# EAGLE design dozimetr-1layer (EAGLE 7.2.0)
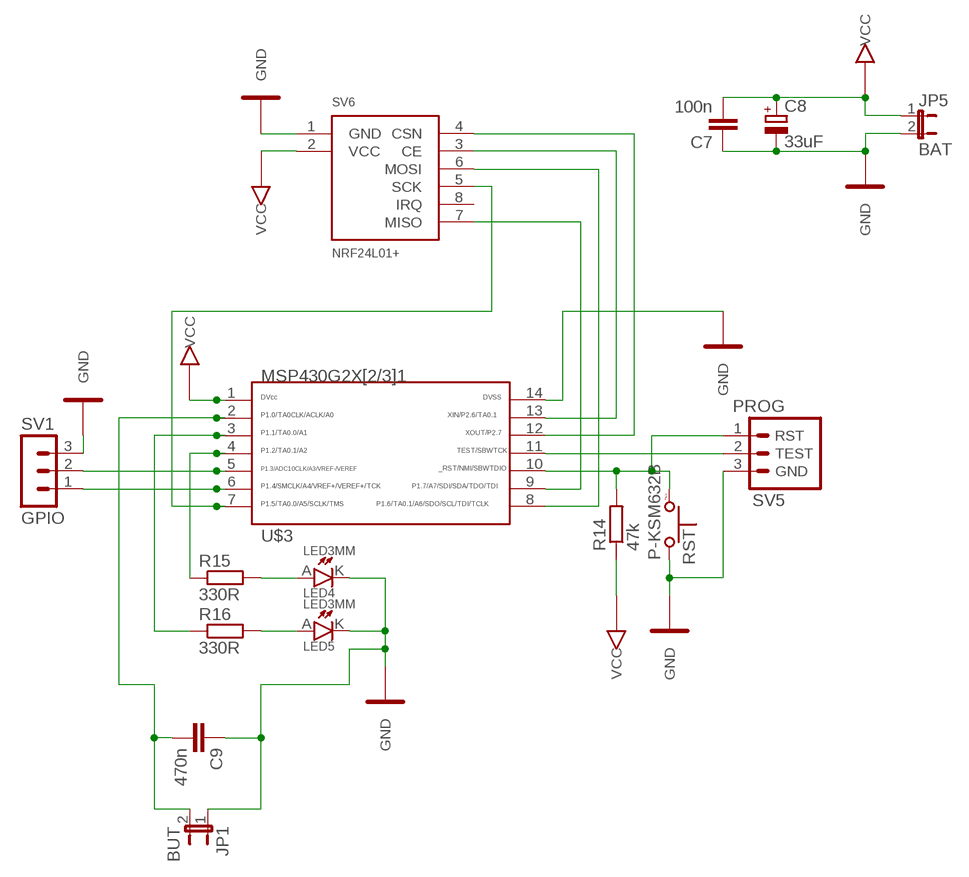
[diagram p0: schematic, sheet 1]

## Parts
C7  100n  C-EUC0805  [C0805]
C8  33uF  CPOL-EUE2,5-6E  [E2,5-6E]
C9  470n  C-EUC0805K  [C0805K]
JP1  BUT  JP1E  [JP1]
JP5  BAT  JP1E  [JP1]
LED4  LED3MM  [LED3MM]
LED5  LED3MM  [LED3MM]
R14  47k  R-EU_R0805  [R0805]
R15  330R  R-EU_R0805  [R0805]
R16  330R  R-EU_R0805  [R0805]
RST  P-KSM632B  [P-KSM632B]
SV1  GPIO  MA03-1  [MA03-1]
SV5  PROG  MA03-1  [MA03-1]
SV6  NRF24L01+  NRF24L01_MOD  [NRF24L01_MOD]
U$3  G2X[2/3]1---PW14  [PW14]

## Nets
GND: C7.1 C8.- C9.1 JP1.1 JP5.2 LED4.K(C) LED5.K(C) RST.2 SV1.3 SV5.3(GND) SV6.1(GND) U$3.14
N$1: C9.2 JP1.2 U$3.2
N$2: SV1.2 U$3.5
N$3: SV1.1 U$3.6
N$27: SV5.2(TEST) U$3.11
N$40: R14.2 RST.1 SV5.1(RST) U$3.10
N$41: SV6.7(MISO) U$3.9
N$42: SV6.6(MOSI) U$3.8
N$43: SV6.5(SCK) U$3.7
N$46: R15.1 U$3.4
N$47: LED4.A R15.2
N$48: SV6.3(CE) U$3.13
N$49: SV6.4(CSN) U$3.12
N$50: R16.1 U$3.3
N$51: LED5.A R16.2
VCC: C7.2 C8.+ JP5.1 R14.1 SV6.2(VCC) U$3.1
Unconnected: SV6.8(IRQ)

## Library data of the parts
C7 C9 = resistor:C-EU: CAPACITOR, European symbol
C8 = resistor:CPOL-EU: POLARIZED CAPACITOR, European symbol
JP1 JP5 = jumper:JP1E: JUMPER
LED4 LED5 = #Krakonos:LED3MM
R14-R16 = resistor:R-EU_: RESISTOR, European symbol
RST = #Krakonos:P-KSM632B: µ-tlacitko
SV1 = con-lstb:MA03-1: PIN HEADER; OC_FARNELL: unknown; OC_NEWARK: unknown
SV5 = #Krakonos:MA03-1: PIN HEADER; OC_FARNELL: unknown; OC_NEWARK: unknown
SV6 = #Krakonos:NRF24L01_MOD: NRF24L01 module header.
U$3 = TI_MSP430_v16:G2X[2/3]1---PW14: MSP430G2X[2/3]1 TSSOP (PW) 14 Pin Package http://focus.ti.com/docs/prod/folders/print/msp430g2221.html MSP430G2121, MSP430G2221, MSP430G2131

## Board
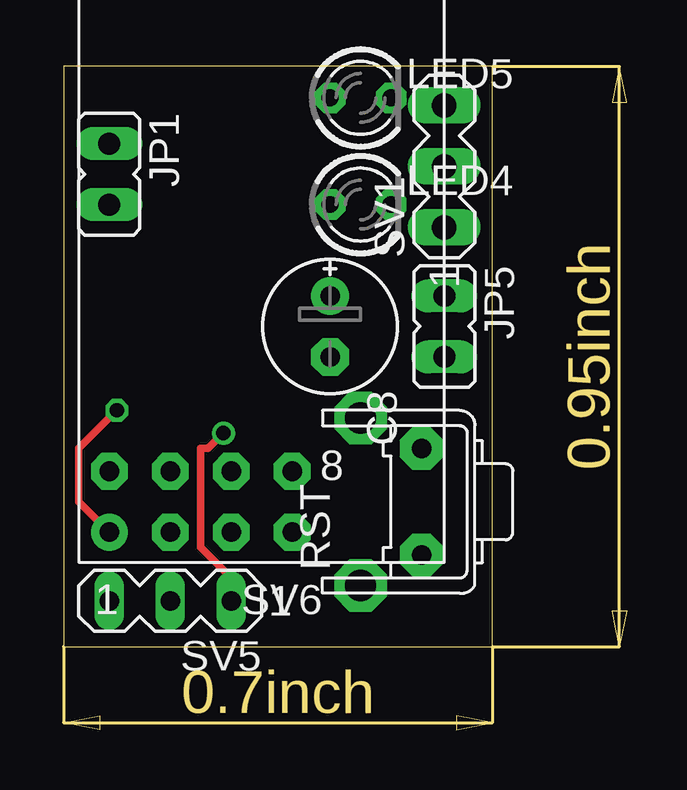
[diagram p1: board, top side]
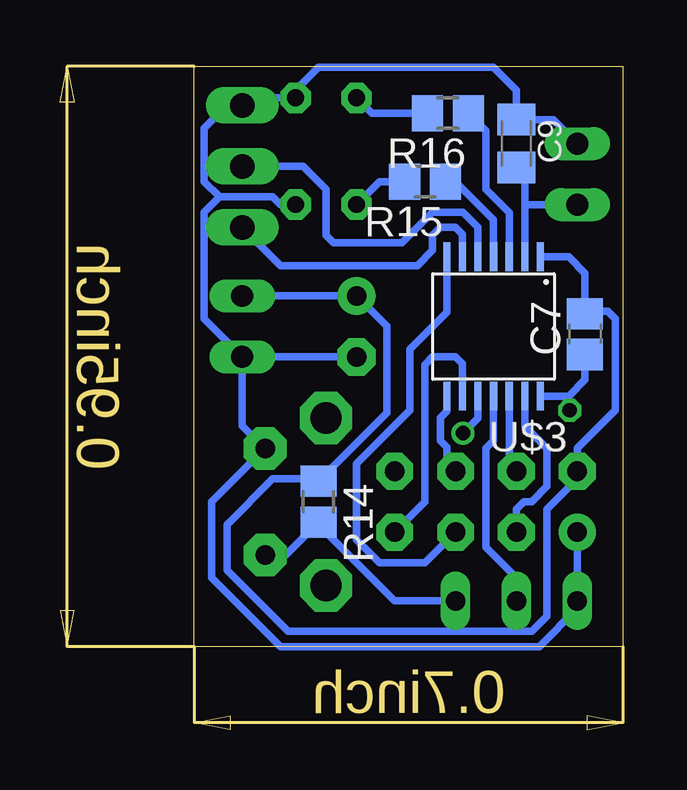
[diagram p2: board, bottom side, seen from below]

Size 17.88 x 24.17 mm. Coordinates in mm from the lower left corner, seen from the top.
Outline: 0,0 17.88,0 17.88,24.17 0,24.17 0,0
Copper layers (1*16): Top 0.0356mm / dielectric 1.5011mm / Bottom 0.0356mm
Design rules "LaenPCBOrder *": minimum track width 6mil, minimum drill 13mil, track to track 6mil, track to pad 6mil, pad to pad 6mil, via to via 6mil, smd to smd 6mil, copper to edge 15mil, drill to drill 6mil, minimum pad ring 7mil, minimum via ring 7mil, stop-mask expansion 3mil, vias tented up to drill 0mil, thermal gap 10mil
bRestrict: area 3.2,11.4 to 6.7,15.2

### Footprints (pad centres in the part's own frame; a part is rotated, then mirrored left to right if it is on the bottom)
C0805 = smd 1.3 x 1.5: 1 -0.85,0; 2 0.85,0
E2,5-6E = drill 0.813 pad 1.575: + -1.27,0 | drill 0.813 pad 1.575 octagon: - 1.27,0
C0805K = smd 1.3 x 1.6: 1 -1,0; 2 1,0
JP1 = drill 0.914 long: 1 0,-1.27; 2 0,1.27
LED3MM = drill 0.7 pad 1.27 octagon: A -1.27,0; K 1.27,0
R0805 = smd 1.3 x 1.5: 1 -0.85,0; 2 0.85,0
P-KSM632B = drill 0.813 pad 1.778 octagon: 1 -2.223,0; 2 2.223,0 | drill 1.3 pad 2.184 octagon: A -3.493,2.54; B 3.493,2.54
MA03-1 = drill 1.016 long: 1 -2.54,0; 2 0,0; 3 2.54,0
MA03-1' = drill 0.813 long: 1 -2.54,0; 2 0,0; 3 2.54,0
NRF24L01_MOD = drill 0.813 pad 1.524: 1 7.62,1.27 | drill 0.813 pad 1.524 octagon: 2 7.62,-1.27; 3 5.08,1.27; 4 5.08,-1.27; 5 2.54,1.27; 6 2.54,-1.27; 7 0,1.27; 8 0,-1.27
PW14 = smd 0.3 x 1.2: 1 -1.95,-2.9; 2 -1.3,-2.9; 3 -0.65,-2.9; 4 0,-2.9; 5 0.65,-2.9; 6 1.3,-2.9; 7 1.95,-2.9; 8 1.95,2.9; 9 1.3,2.9; 10 0.65,2.9; 11 0,2.9; 12 -0.65,2.9; 13 -1.3,2.9; 14 -1.95,2.9

### Placement (x,y rotation side)
C7  1.59,13.02 90 bottom
C8  11.11,13.33 270 top
C9  4.45,20.95 270 bottom
JP1  1.9,19.68 180 top
JP5  15.88,13.33 180 top
LED4  12.38,18.41 0 top
LED5  12.38,22.86 0 top
R14  12.7,6.03 270 bottom
R15  8.25,19.37 180 bottom
R16  7.3,22.22 180 bottom
RST  14.92,6.03 90 top
SV1  15.88,20 90 top
SV5  PROG  [MA03-1']  4.45,1.9 180 top
SV6  9.53,6.03 180 top
U$3  5.4,13.33 180 bottom

### Tracks (layer width: path | path; a pad name or v marks a point on that pad's centre or on a via)
GND  (via drill 0.6)
  Top 0.308: v2.22,9.84 0.63,8.25 0.63,6.03 SV6.1
  Bottom 0.308: C8.- JP5.2 | JP1.1 2.9,21.95 C9.1 4.45,23.18 5.4,24.13 12.7,24.13 13.65,23.18 LED5.K 15.56,22.86 SV1.3 16.51,22.54 17.46,21.59 17.46,19.37 16.83,18.73 | JP5.2 15.88,9.21 RST.2 17.14,6.03 17.14,2.86 14.29,0 3.49,0 1.9,1.59 SV5.3 SV6.1 | LED4.K 14.29,18.41 14.61,18.73 16.83,18.73 | 16.83,18.73 17.46,18.1 17.46,13.65 JP5.2 | U$3.14 2.26,10.43 | 2.26,10.43 1.59,11.11 C7.1 | 2.26,10.43 2.26,9.88 v2.22,9.84
N$1
  Bottom 0.308: U$3.2 4.1,18.41 | 4.1,18.41 4.1,19.61 C9.2 | JP1.2 4.1,18.41
N$2
  Bottom 0.308: U$3.5 6.05,17.48 6.67,18.1 7.94,18.1 9.21,16.83 12.07,16.83 12.38,17.14 12.38,19.05 13.34,20 SV1.2
N$3
  Bottom 0.308: U$3.6 6.7,17.17 6.98,17.46 7.62,17.46 7.94,17.14 7.94,16.51 8.57,15.88 14.29,15.88 SV1.1
N$27
  Bottom 0.308: SV5.2 4.45,2.86 5.71,4.13 5.71,8.25 5.4,8.57 U$3.11
N$40  (via drill 0.6)
  Top 0.308: v6.67,8.89 6.03,8.25 5.71,8.25 5.71,4.13 6.98,2.86 SV5.1
  Bottom 0.308: U$3.10 6.05,9.51 v6.67,8.89 | RST.1 14.07,3.81 R14.2 12.7,5.08 9.53,1.9 SV5.1
N$41
  Bottom 0.308: U$3.9 6.7,11.78 6.98,12.06 7.94,12.06 8.25,11.75 8.25,6.03 SV6.7
N$42
  Bottom 0.308: SV6.6 7.35,7.66 7.35,8.3 7.62,8.57 7.62,9.52 7.35,9.8 U$3.8
N$43
  Bottom 0.308: U$3.7 7.35,13.92 8.89,12.38 8.89,9.84 11.11,7.62 11.11,4.45 10.16,3.49 8.25,3.49 SV6.5
N$46
  Bottom 0.308: U$3.4 5.4,17.78 6.98,19.37 R15.1
N$47
  Bottom 0.308: R15.2 10.16,19.37 LED4.A
N$48
  Bottom 0.308: U$3.13 4.1,9.18 3.17,8.25 3.17,6.67 3.81,6.03 4.13,6.03 4.45,5.71 SV6.3
N$49
  Bottom 0.308: U$3.12 4.75,7.6 SV6.4
N$50
  Bottom 0.308: U$3.3 4.75,18.08 5.71,19.05 5.71,21.49 R16.1
N$51
  Bottom 0.308: R16.2 10.48,22.22 LED5.A
VCC
  Bottom 0.308: U$3.1 2.26,16.23 1.59,15.56 C7.2 1.48,13.97 0.63,13.97 0.32,13.65 0.32,9.84 1.9,8.25 SV6.2 2.22,6.98 2.22,6.67 3.17,5.71 3.17,1.27 3.81,0.63 13.97,0.63 16.51,3.17 16.51,5.08 14.61,6.98 12.7,6.98 R14.1 9.84,9.74 9.84,13.33 C8.+ JP5.1